# Altium schematic sheet uC_output.SchDoc
size A; SheetNumber: 11; SheetTotal: 11
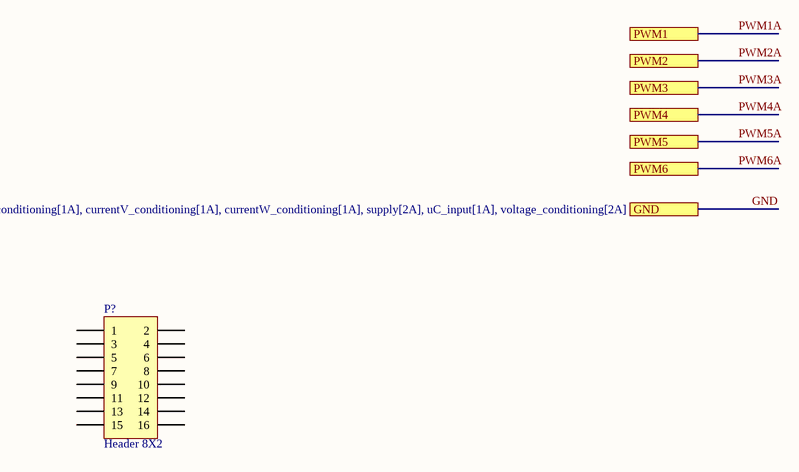
[diagram p0: uC_output.SchDoc]

## Parts
P?  Header 8X2  [HDR2X8]

## Ports
GND (see main[1C], buffer[2A], control_connector[2D], currentU_conditioning[1A], currentV_conditioning[1A], currentW_conditioning[1A], supply[2A], uC_input[1A], voltage_conditioning[2A]), PWM1, PWM2, PWM3, PWM4, PWM5, PWM6

## Nets
GND: port GND
PWM1A: port PWM1
PWM2A: port PWM2
PWM3A: port PWM3
PWM4A: port PWM4
PWM5A: port PWM5
PWM6A: port PWM6

Not connected (* = marked no-connect by the designer): P? 1 2 3 4 5 6 7 8 9 10 11 12 13 14 15 16

## Library data of the parts
P? = Header 8X2: Header, 8-Pin, Dual row; LatestRevisionDate: 17-Jul-2002; LatestRevisionNote: Re-released for DXP Platform.; Publisher: Altium Limited